# EasyEDA Pro project ProPrj_GSPro Keyboard_2026-01-17.epro, board KEYBOARD
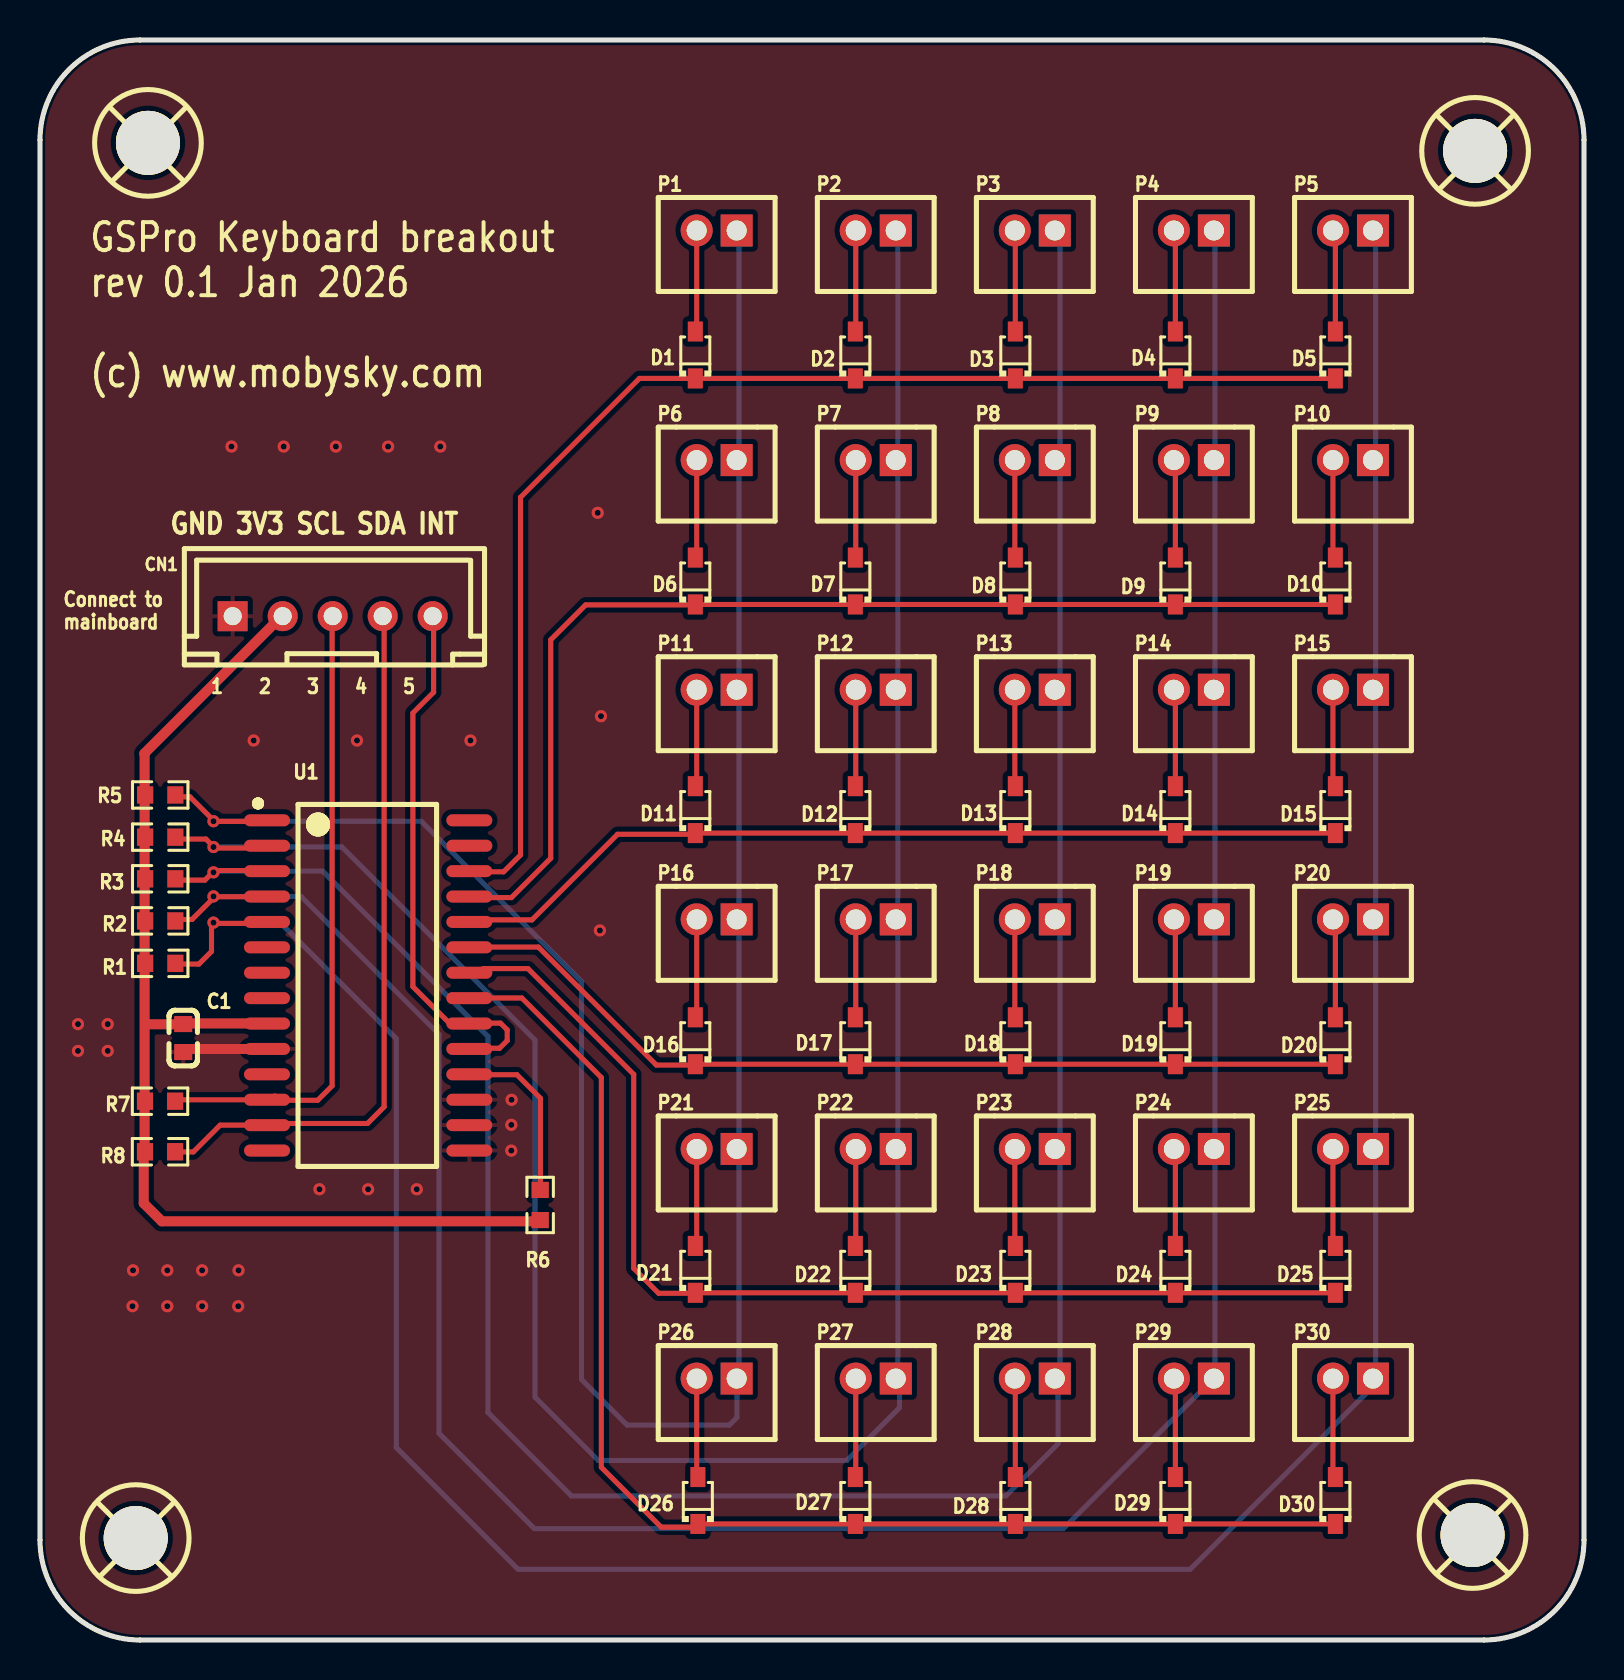
[diagram p3: board, top side]
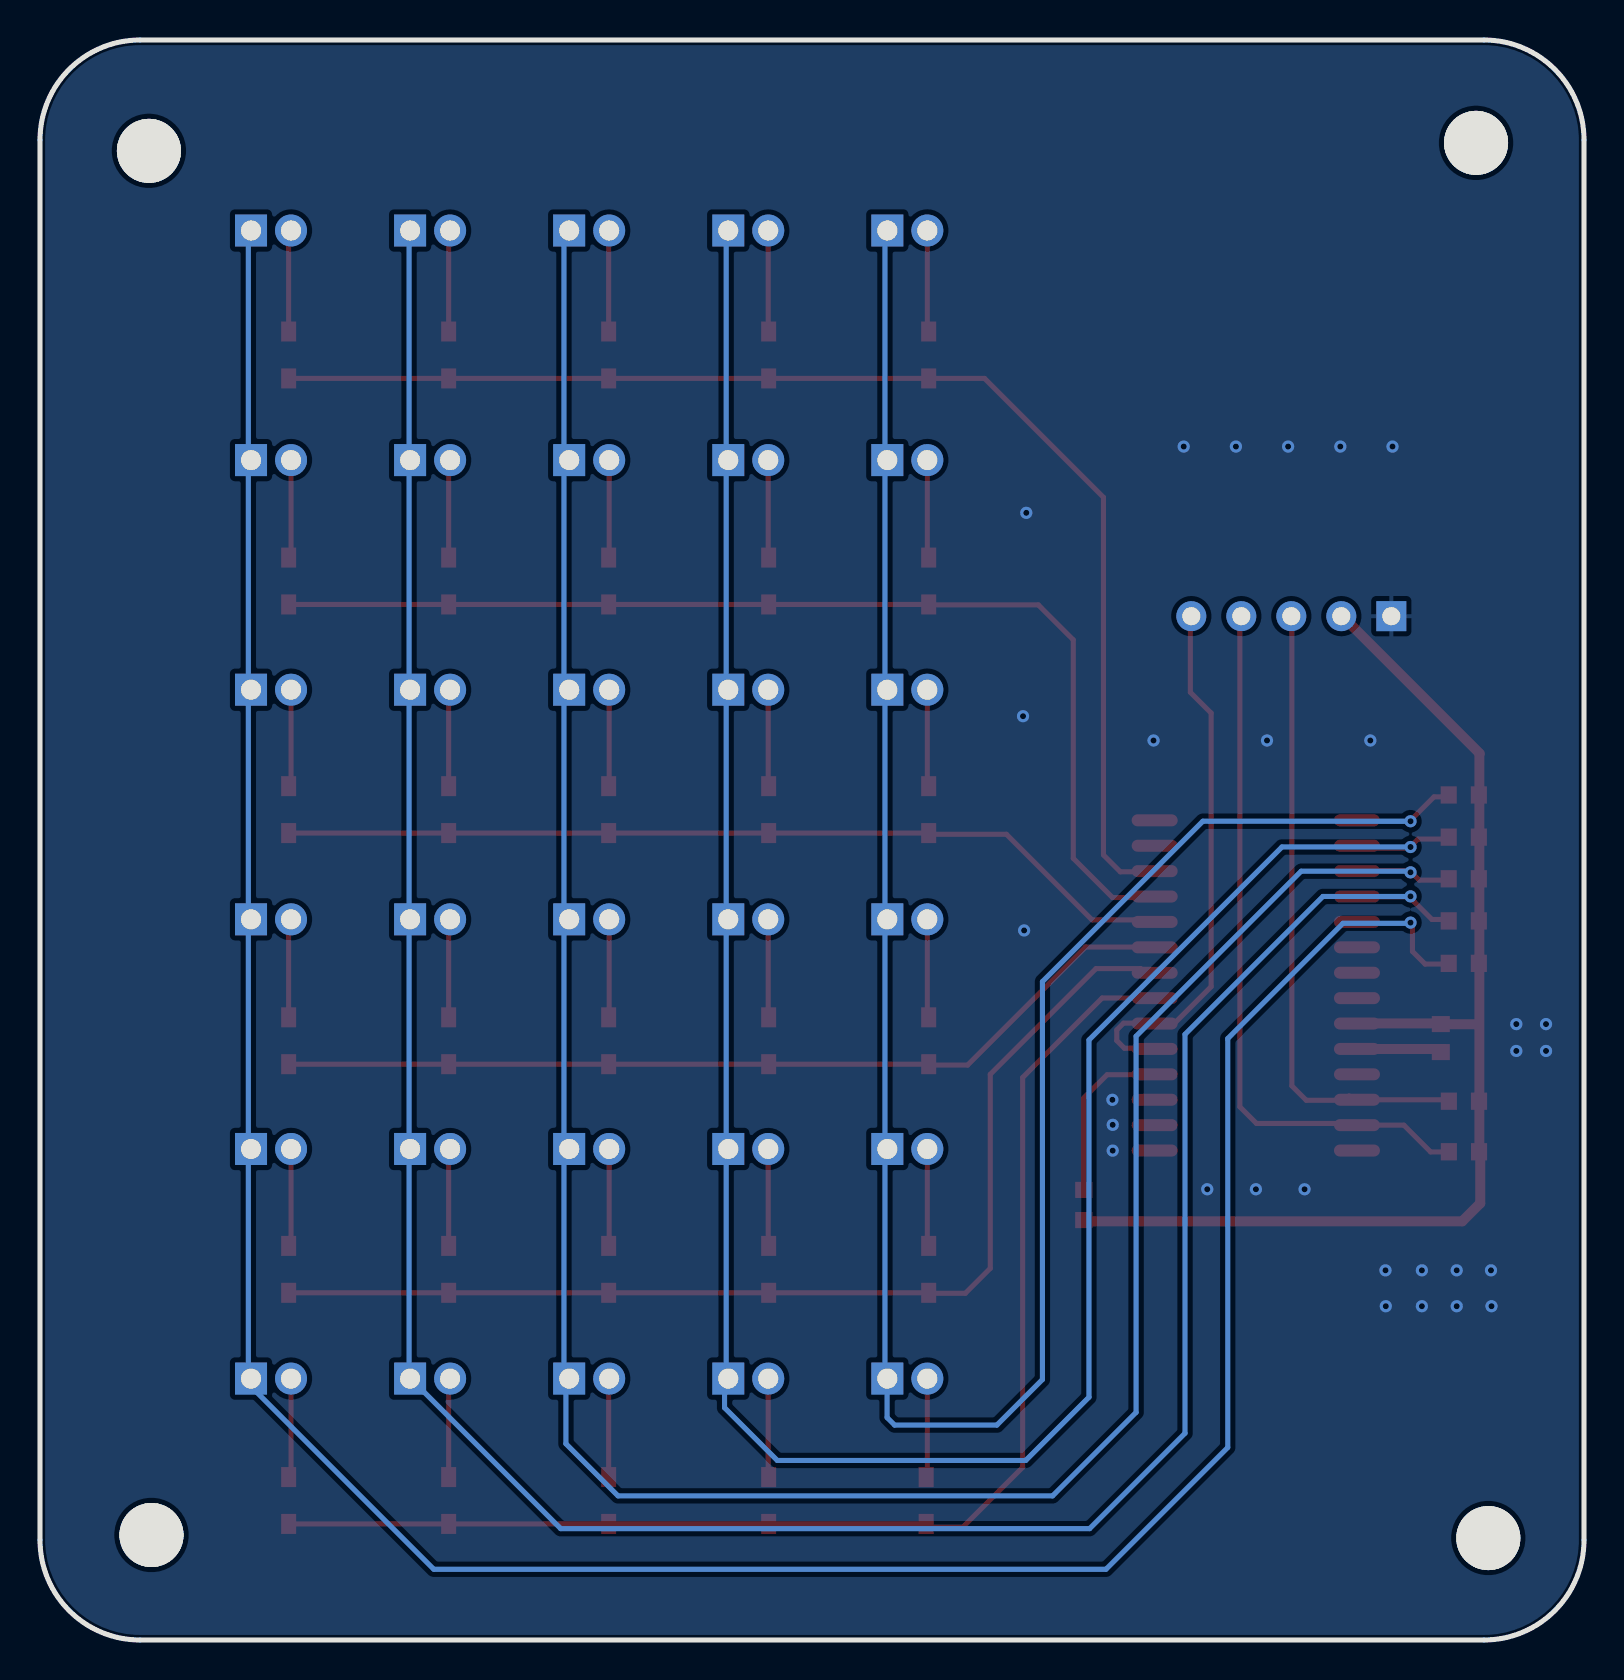
[diagram p4: board, bottom side, seen from below]

Outline 77.2 x 80 mm; copper layers: Top Layer, Bottom Layer. Coordinates in mm from the lower left corner of the outline.
Outline path: 0,75 0,5 arc(1.46,1.46) 5,0 72.2,0 arc(75.74,1.46) 77.2,5 77.2,75 arc(75.74,78.54) 72.2,80 5,80 arc(1.46,78.54) 0,75
Stack: Top Layer 0.035mm / Dielectric1 1.51mm FR4 er 4.5 / Bottom Layer 0.035mm

## Design rules (mm)
template: JLCPCB Capability(Two Layers Board)
spacing copperThickness1oz (default): track to track 0.102, other pairs 0.152 to 0.3
spacing copperThickness2oz: track to track 0.203, other pairs 0.152 to 0.3
track width copperThickness1oz (default): min 0.127, default 0.254, max 2.54
track width copperThickness2oz: min 0.203, default 0.254, max 2.54
differential pair differentialPair (default): width min 0.127, default 0.254, max 2.54; gap min 0.152, default 0.152
via viaSize (default): diameter min 0.5, default 0.61, max 10; hole min 0.3, default 0.305, max 6.3

## Placement (name value [footprint] x y rotation side)
C1  100nF  [C0603]  7.16 30.1 90 top
CN1  WAFER-XH254Z-5AM  [CONN-TH_5P-P2.50_WAFER-XH254Z-5A]  14.64 51.19 0 top
D1  1N4148WS  [SOD-323_L1.8-W1.3-LS2.5-RD]  32.77 64.25 90 top
D2  1N4148WS  [SOD-323_L1.8-W1.3-LS2.5-RD]  40.77 64.25 90 top
D3  1N4148WS  [SOD-323_L1.8-W1.3-LS2.5-RD]  48.77 64.25 90 top
D4  1N4148WS  [SOD-323_L1.8-W1.3-LS2.5-RD]  56.77 64.25 90 top
D5  1N4148WS  [SOD-323_L1.8-W1.3-LS2.5-RD]  64.77 64.25 90 top
D6  1N4148WS  [SOD-323_L1.8-W1.3-LS2.5-RD]  32.77 52.95 90 top
D7  1N4148WS  [SOD-323_L1.8-W1.3-LS2.5-RD]  40.77 52.95 90 top
D8  1N4148WS  [SOD-323_L1.8-W1.3-LS2.5-RD]  48.77 52.95 90 top
D9  1N4148WS  [SOD-323_L1.8-W1.3-LS2.5-RD]  56.77 52.95 90 top
D10  1N4148WS  [SOD-323_L1.8-W1.3-LS2.5-RD]  64.77 52.95 90 top
D11  1N4148WS  [SOD-323_L1.8-W1.3-LS2.5-RD]  32.77 41.52 90 top
D12  1N4148WS  [SOD-323_L1.8-W1.3-LS2.5-RD]  40.77 41.52 90 top
D13  1N4148WS  [SOD-323_L1.8-W1.3-LS2.5-RD]  48.77 41.52 90 top
D14  1N4148WS  [SOD-323_L1.8-W1.3-LS2.5-RD]  56.77 41.52 90 top
D15  1N4148WS  [SOD-323_L1.8-W1.3-LS2.5-RD]  64.77 41.52 90 top
D16  1N4148WS  [SOD-323_L1.8-W1.3-LS2.5-RD]  32.77 29.96 90 top
D17  1N4148WS  [SOD-323_L1.8-W1.3-LS2.5-RD]  40.77 29.96 90 top
D18  1N4148WS  [SOD-323_L1.8-W1.3-LS2.5-RD]  48.77 29.96 90 top
D19  1N4148WS  [SOD-323_L1.8-W1.3-LS2.5-RD]  56.77 29.96 90 top
D20  1N4148WS  [SOD-323_L1.8-W1.3-LS2.5-RD]  64.77 29.96 90 top
D21  1N4148WS  [SOD-323_L1.8-W1.3-LS2.5-RD]  32.77 18.53 90 top
D22  1N4148WS  [SOD-323_L1.8-W1.3-LS2.5-RD]  40.77 18.53 90 top
D23  1N4148WS  [SOD-323_L1.8-W1.3-LS2.5-RD]  48.77 18.53 90 top
D24  1N4148WS  [SOD-323_L1.8-W1.3-LS2.5-RD]  56.77 18.53 90 top
D25  1N4148WS  [SOD-323_L1.8-W1.3-LS2.5-RD]  64.77 18.53 90 top
D26  1N4148WS  [SOD-323_L1.8-W1.3-LS2.5-RD]  32.89 6.97 90 top
D27  1N4148WS  [SOD-323_L1.8-W1.3-LS2.5-RD]  40.77 6.97 90 top
D28  1N4148WS  [SOD-323_L1.8-W1.3-LS2.5-RD]  48.77 6.97 90 top
D29  1N4148WS  [SOD-323_L1.8-W1.3-LS2.5-RD]  56.77 6.97 90 top
D30  1N4148WS  [SOD-323_L1.8-W1.3-LS2.5-RD]  64.77 6.97 90 top
P1  PH-2A  [CONN-TH_2P-P2.00_PH-2A_C2319]  33.83 70.48 0 top
P2  PH-2A  [CONN-TH_2P-P2.00_PH-2A_C2319]  41.79 70.47 0 top
P3  PH-2A  [CONN-TH_2P-P2.00_PH-2A_C2319]  49.74 70.47 0 top
P4  PH-2A  [CONN-TH_2P-P2.00_PH-2A_C2319]  57.7 70.47 0 top
P5  PH-2A  [CONN-TH_2P-P2.00_PH-2A_C2319]  65.65 70.47 0 top
P6  PH-2A  [CONN-TH_2P-P2.00_PH-2A_C2319]  33.83 58.99 0 top
P7  PH-2A  [CONN-TH_2P-P2.00_PH-2A_C2319]  41.79 58.99 0 top
P8  PH-2A  [CONN-TH_2P-P2.00_PH-2A_C2319]  49.74 58.99 0 top
P9  PH-2A  [CONN-TH_2P-P2.00_PH-2A_C2319]  57.7 58.99 0 top
P10  PH-2A  [CONN-TH_2P-P2.00_PH-2A_C2319]  65.65 58.99 0 top
P11  PH-2A  [CONN-TH_2P-P2.00_PH-2A_C2319]  33.83 47.51 0 top
P12  PH-2A  [CONN-TH_2P-P2.00_PH-2A_C2319]  41.79 47.51 0 top
P13  PH-2A  [CONN-TH_2P-P2.00_PH-2A_C2319]  49.74 47.51 0 top
P14  PH-2A  [CONN-TH_2P-P2.00_PH-2A_C2319]  57.7 47.51 0 top
P15  PH-2A  [CONN-TH_2P-P2.00_PH-2A_C2319]  65.65 47.51 0 top
P16  PH-2A  [CONN-TH_2P-P2.00_PH-2A_C2319]  33.83 36.03 0 top
P17  PH-2A  [CONN-TH_2P-P2.00_PH-2A_C2319]  41.79 36.03 0 top
P18  PH-2A  [CONN-TH_2P-P2.00_PH-2A_C2319]  49.74 36.03 0 top
P19  PH-2A  [CONN-TH_2P-P2.00_PH-2A_C2319]  57.7 36.03 0 top
P20  PH-2A  [CONN-TH_2P-P2.00_PH-2A_C2319]  65.65 36.03 0 top
P21  PH-2A  [CONN-TH_2P-P2.00_PH-2A_C2319]  33.83 24.55 0 top
P22  PH-2A  [CONN-TH_2P-P2.00_PH-2A_C2319]  41.79 24.55 0 top
P23  PH-2A  [CONN-TH_2P-P2.00_PH-2A_C2319]  49.74 24.55 0 top
P24  PH-2A  [CONN-TH_2P-P2.00_PH-2A_C2319]  57.7 24.55 0 top
P25  PH-2A  [CONN-TH_2P-P2.00_PH-2A_C2319]  65.65 24.55 0 top
P26  PH-2A  [CONN-TH_2P-P2.00_PH-2A_C2319]  33.83 13.07 0 top
P27  PH-2A  [CONN-TH_2P-P2.00_PH-2A_C2319]  41.79 13.07 0 top
P28  PH-2A  [CONN-TH_2P-P2.00_PH-2A_C2319]  49.74 13.07 0 top
P29  PH-2A  [CONN-TH_2P-P2.00_PH-2A_C2319]  57.7 13.07 0 top
P30  PH-2A  [CONN-TH_2P-P2.00_PH-2A_C2319]  65.65 13.07 0 top
R1  10kΩ  [R0603]  6.01 33.83 0 top
R2  10kΩ  [R0603]  6.01 35.96 0 top
R3  10kΩ  [R0603]  6.01 38.06 0 top
R4  10kΩ  [R0603]  6.01 40.14 0 top
R5  10kΩ  [R0603]  6.01 42.25 0 top
R6  10kΩ  [R0603]  25.01 21.75 90 top
R7  4.7kΩ  [R0603]  6 26.94 180 top
R8  4.7kΩ  [R0603]  6 24.41 0 top
SCREW1  -  [Screw-Hole-M3]  4.85 5.03 0 top
SCREW2  -  [Screw-Hole-M3]  5.46 74.79 0 top
SCREW3  -  [Screw-Hole-M3]  71.82 74.39 0 top
SCREW4  -  [Screw-Hole-M3]  71.69 5.19 0 top
U1  MCP23017-E/SO  [SOIC-28_L18.0-W7.5-P1.27-LS10.3-BL]  16.41 32.73 270 top

## Footprints (pads in the part's own frame, mm; a bottom-side part is the same pattern mirrored in y, then rotated)
C0603
  rect 0.8x0.9 smd: 1(-0.7,0) 2(0.7,0)
CONN-TH_2P-P2.00_PH-2A_C2319
  rect 1.6x1.6 hole 1: 1(1,0)
  round 1.6 hole 1: 2(-1,0)
CONN-TH_5P-P2.50_WAFER-XH254Z-5A
  rect 1.5x1.5 hole 0.9: 1(-5,0)
  round 1.5 hole 0.9: 2(-2.5,0) 3(0,0) 4(2.5,0) 5(5,0)
R0603
  rect 0.806x0.864 smd: 1(-0.753,0) 2(0.753,0)
Screw-Hole-M3
  round 3.2 hole 3.2: 1(-0.064,0.064)
SOD-323_L1.8-W1.3-LS2.5-RD
  rect 1x0.75 smd: 1(-1.173,0) 2(1.173,0)
SOIC-28_L18.0-W7.5-P1.27-LS10.3-BL
  oval 0.6x2.3 smd: 1(-8.255,-5.058) 2(-6.985,-5.058) 3(-5.715,-5.058) 4(-4.445,-5.058) 5(-3.175,-5.058) 6(-1.905,-5.058) 7(-0.635,-5.058) 8(0.635,-5.058) 9(1.905,-5.058) 10(3.175,-5.058) 11(4.445,-5.058) 12(5.715,-5.058) 13(6.985,-5.058) 14(8.255,-5.058) 15(8.255,5.058) 16(6.985,5.058) 17(5.715,5.058) 18(4.445,5.058) 19(3.175,5.058) 20(1.905,5.058) 21(0.635,5.058) 22(-0.635,5.058) 23(-1.905,5.058) 24(-3.175,5.058) 25(-4.445,5.058) 26(-5.715,5.058) 27(-6.985,5.058) 28(-8.255,5.058)

## Nets
As in the schematic.

Pads without a net: SCREW1 1; SCREW2 1; SCREW3 1; SCREW4 1; U1 6 7 8 11 14 27 28

## Via types
v1: diameter 0.61, hole 0.305, Top Layer to Bottom Layer, 34 vias

## Routing (per net, layer and track width the routed paths; a pad name or vN(x,y) marks a point on that pad's centre or on a via; arc(x,y) is an arc through that point)
3V3: length 57.6
  Top Layer w0.5: 5.13,24.36 5.23,24.47 5.23,44.32 ; 7.11,30.92 7.2,30.83 11.03,30.83 ; 11.83,50.94 5.21,44.32 ; 5.19,24.3 5.19,21.84 6.09,20.93 24.92,20.93 ; 7.07,30.79 5.36,30.79
GND: length 4.1
  Top Layer w0.5: 11.11,29.59 11.07,29.55 7,29.55
  vias: v1(1.9,30.8) v1(1.9,29.45) v1(3.39,30.8) v1(3.39,29.45) v1(4.65,18.48) v1(4.63,16.69) v1(6.37,18.48) v1(6.37,16.69) v1(8.11,18.48) v1(8.11,16.69) v1(9.57,59.67) v1(9.91,16.69) v1(9.93,18.48) v1(10.68,44.98) v1(12.18,59.67) v1(13.97,22.54) v1(14.79,59.67) v1(15.85,44.98) v1(16.41,22.54) v1(17.4,59.67) v1(18.84,22.54) v1(20.02,59.67) v1(21.52,44.98) v1(23.58,27.01) v1(23.57,25.76) v1(23.57,24.47) v1(27.89,56.36) v1(27.99,35.48) v1(28.05,46.19)
COL1: length 114.2
  Top Layer w0.254: 6.68,42.16 7.5,42.16 8.61,41.05 ; 8.61,41.01 8.69,40.93 10.65,40.93
  Bottom Layer w0.254: v1(8.67,40.94) 19.06,40.94 27.08,32.92 27.08,13.02 29.36,10.75 34.47,10.75 34.85,11.12 34.85,13.12 ; 34.95,70.44 34.95,13.22
COL2: length 121.4
  Top Layer w0.254: 6.86,40.05 8.3,40.05 8.68,39.67 ; 8.68,39.6 10.67,39.6 10.71,39.64
  Bottom Layer w0.254: 42.97,13.02 42.97,11.62 40.33,8.98 27.91,8.98 24.75,12.14 24.75,30 15.1,39.65 8.76,39.65 ; 42.89,13.02 42.89,70.52
  vias: v1(8.67,39.65)
COL3: length 131.8
  Top Layer w0.254: 8.63,38.38 8.24,37.99 6.86,37.99 ; 10.61,38.47 8.83,38.47
  Bottom Layer w0.254: 50.78,13.01 51,13.23 51,70.6 ; 8.76,38.44 14.14,38.44 22.4,30.19 22.4,11.38 26.57,7.21 48.3,7.21 50.9,9.81 50.9,12.99
  vias: v1(8.67,38.38)
COL4: length 138.8
  Top Layer w0.254: 8.62,37.16 8.62,37.05 7.6,36.03 7.03,36.03 ; 10.49,37.16 8.68,37.16
  Bottom Layer w0.254: 58.75,70.45 58.75,13.3 ; 58.6,13.16 58.61,13.17 ; 58.69,13.09 51.17,5.57 24.72,5.57 19.95,10.34 19.95,30.28 13.05,37.18 8.84,37.18
  vias: v1(8.67,37.18)
COL5: length 150
  Top Layer w0.254: 6.89,33.8 7.95,33.8 8.58,34.43 8.58,35.67 8.74,35.83 ; 10.46,35.83 8.74,35.83 ; 8.74,35.83 8.74,35.97
  Bottom Layer w0.254: 66.78,70.67 66.78,13.38 66.93,13.23 ; 8.79,35.83 12.05,35.83 17.81,30.07 17.81,9.62 23.9,3.53 57.51,3.53 66.81,12.83
  vias: v1(8.67,35.87)
KB_INT: length 25.1
  Top Layer w0.254: 19.68,51.16 19.68,47.39 18.64,46.35 18.64,32.67 20.55,30.76 20.87,30.76 ; 22.43,30.84 23.02,30.84 23.36,30.5 23.36,29.97 22.98,29.59 21.96,29.59
KB_SCL: length 30.2
  Top Layer w0.254: 10.45,26.95 10.39,27.01 6.97,27.01 ; 11.75,27.2 11.96,26.99 13.89,26.99 14.61,27.71 14.61,51.11
KB_SDA: length 34.3
  Top Layer w0.254: 6.81,24.4 7.67,24.4 9.01,25.74 10.67,25.74 ; 12.29,25.83 16.38,25.83 17.21,26.66 17.21,51.08 17.03,51.26
ROW1: length 63.2
  Top Layer w0.254: 22.32,38.44 22.35,38.41 23.18,38.41 24.03,39.25 24.03,57.13 29.97,63.08 D1.1 D2.1 D3.1 D4.1 D5.1
ROW2: length 54.9
  Top Layer w0.254: 32.88,51.69 32.81,51.76 27.29,51.76 25.54,50.01 25.54,39.09 23.57,37.12 22.43,37.12 ; D10.1 D9.1 D8.1 D7.1 D6.1
ROW3: length 44.1
  Top Layer w0.254: D15.1 D14.1 D13.1 D12.1 D11.1 ; 21.71,35.91 21.69,35.94 ; 22.37,36 24.6,36 28.88,40.29 32.66,40.29
ROW4: length 45.3
  Top Layer w0.254: D20.1 D19.1 D18.1 D17.1 D16.1 ; 21.82,34.65 24.92,34.65 30.82,28.75 32.66,28.75
ROW5: length 55.3
  Top Layer w0.254: 22.02,33.41 22.17,33.57 24.4,33.57 29.69,28.28 29.69,18.58 30.93,17.34 32.77,17.34 32.92,17.18 ; D25.1 D24.1 D23.1 D22.1 32.92,17.36
ROW6: length 64.6
  Top Layer w0.254: D30.1 D29.1 D28.1 D27.1 33.18,5.8 ; 32.87,5.79 32.72,5.64 31.06,5.64 28.07,8.63 28.07,28.12 24.09,32.1 22.32,32.1
$1N4778: length 8.3
  Top Layer w0.254: 21.7,28.26 23.85,28.26 25.02,27.09 25.02,22.62
$1N5405: length 5.1
  Top Layer w0.254: D1.2 32.83,65.49 P1.2
$1N5418: length 5.1
  Top Layer w0.254: P2.2 40.79,65.45 D2.2
$1N5463: length 5.1
  Top Layer w0.254: P3.2 48.77,70.45 D3.2
$1N5483: length 5.1
  Top Layer w0.254: P4.2 56.77,70.4 D4.2
$1N5973: length 4.9
  Top Layer w0.254: P6.2 32.83,54.19 D6.2
$1N5975: length 4.9
  Top Layer w0.254: P7.2 40.79,54.14 D7.2
$1N5981: length 4.9
  Top Layer w0.254: D8.2 48.74,54.15 P8.2
$1N5985: length 4.9
  Top Layer w0.254: P9.2 56.77,58.92 D9.2
$1N6068: length 5.1
  Top Layer w0.254: D5.2 64.77,70.35 P5.2
$1N6080: length 4.9
  Top Layer w0.254: P10.2 64.65,54.24 D10.2
$1N6555: length 4.9
  Top Layer w0.254: D11.2 32.83,42.76 P11.2
$1N6557: length 4.9
  Top Layer w0.254: D14.2 56.77,47.44 P14.2
$1N6559: length 4.8
  Top Layer w0.254: P12.2 40.79,42.71 D12.2
$1N6561: length 4.8
  Top Layer w0.254: D13.2 48.74,42.72 P13.2
$1N6576: length 4.9
  Top Layer w0.254: D15.2 64.65,42.81 P15.2
$1N7082: length 4.9
  Top Layer w0.254: P16.2 32.83,31.2 D16.2
$1N7084: length 4.9
  Top Layer w0.254: P19.2 56.77,35.96 D19.2
$1N7086: length 4.9
  Top Layer w0.254: P17.2 40.79,31.16 D17.2
$1N7088: length 4.9
  Top Layer w0.254: P18.2 48.74,31.16 D18.2
$1N7103: length 4.9
  Top Layer w0.254: P20.2 64.77,35.91 D20.2
$1N7621: length 4.9
  Top Layer w0.254: P21.2 32.83,19.77 D21.2
$1N7623: length 4.9
  Top Layer w0.254: D24.2 56.77,24.48 P24.2
$1N7625: length 4.9
  Top Layer w0.254: P22.2 40.79,19.73 D22.2
$1N7627: length 4.9
  Top Layer w0.254: D23.2 48.74,19.73 P23.2
$1N7640: length 4.9
  Top Layer w0.254: D25.2 64.65,19.83 P25.2
$1N8168: length 4.9
  Top Layer w0.254: D26.2 32.83,8.21 P26.2
$1N8170: length 5
  Top Layer w0.254: D29.2 56.77,13 P29.2
$1N8172: length 4.9
  Top Layer w0.254: D27.2 40.79,8.17 P27.2
$1N8174: length 4.9
  Top Layer w0.254: P28.2 48.77,13.04 D28.2
$1N8187: length 5
  Top Layer w0.254: P30.2 64.65,8.27 D30.2

## Copper pours and planes (outline as drawn; the poured copper is in the pictures)
GND on Top Layer: -1.23,81.31 78.45,81.31 78.45,-0.91 -1.23,-0.91
GND on Bottom Layer: -0.88,80.55 78.24,80.55 78.24,-1.1 -0.88,-1.1

## Text on the board
Top Silkscreen Layer: Connect to / mainboard | 1    2    3    4    5 | GND 3V3 SCL SDA INT | GSPro Keyboard breakout / rev 0.1 Jan 2026 / (c) www.mobysky.com
